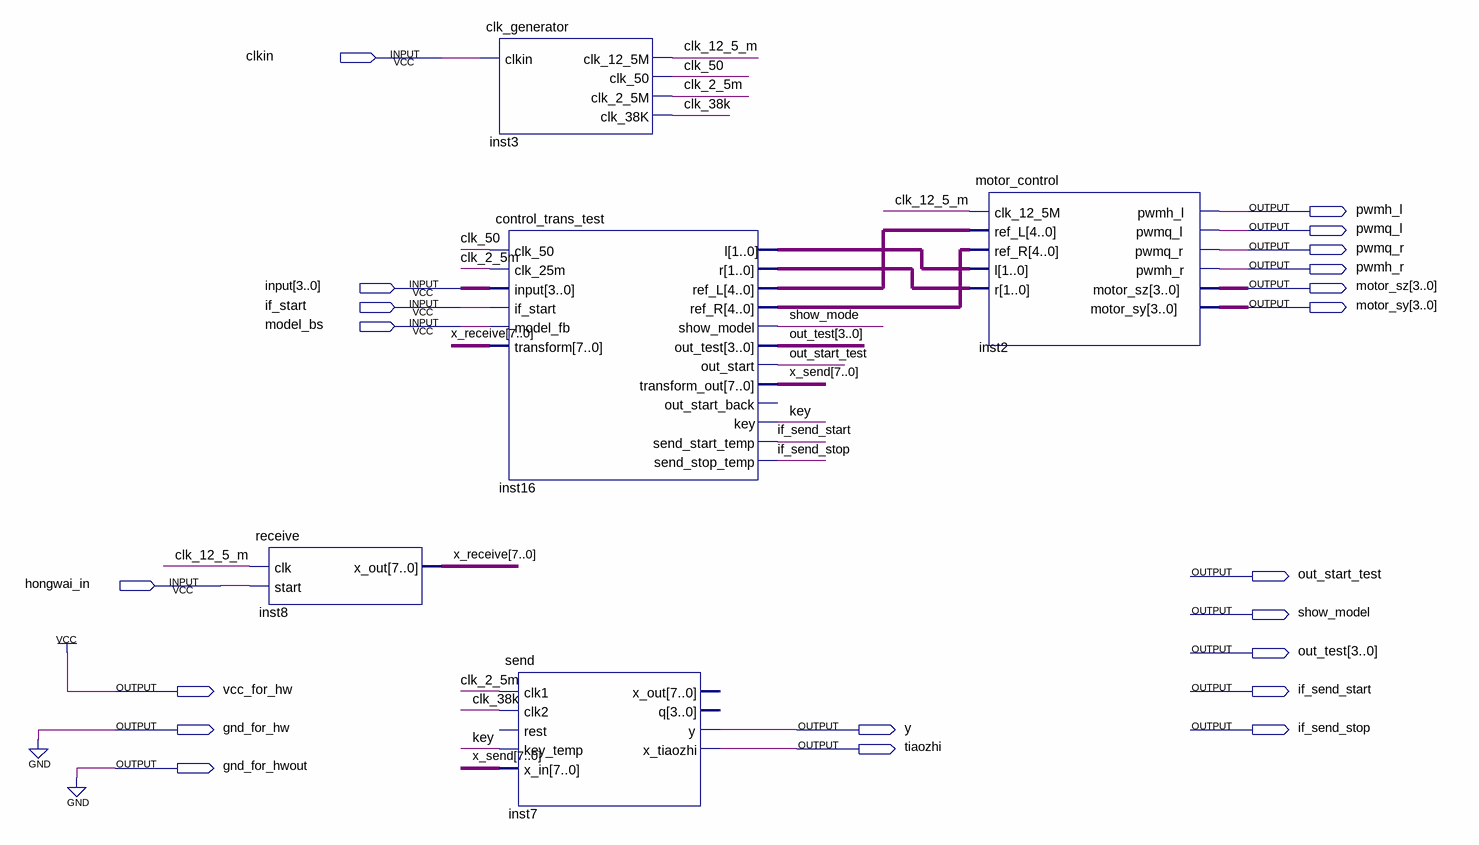
[diagram p0: schematic sheet]
// Quartus schematic car.bdf as structural Verilog: 5 symbols, 21 pins
module car (
  input  clkin,
  input  [3:0] \input ,
  input  if_start,
  input  model_bs,
  input  hongwai_in,
  output pwmh_l,
  output pwmq_l,
  output pwmq_r,
  output pwmh_r,
  output [3:0] motor_sz,
  output [3:0] motor_sy,
  output out_start_test,
  output show_model,
  output [3:0] out_test,
  output vcc_for_hw,
  output if_send_start,
  output gnd_for_hw,
  output y,
  output if_send_stop,
  output tiaozhi,
  output gnd_for_hwout
);

  wire clk_2_5m, clk_12_5_m, clk_38k, clk_50, key, show_mode;
  wire [1:0] inst16_l, inst16_r;
  wire [4:0] inst16_ref_l, inst16_ref_r;
  wire [7:0] x_receive, x_send;

  receive inst8 (.clk(clk_12_5_m), .start(hongwai_in), .x_out(x_receive));
  clk_generator inst3 (.clkin(clkin), .clk_12_5M(clk_12_5_m), .clk_50(clk_50), .clk_2_5M(clk_2_5m), .clk_38K(clk_38k));
  control_trans_test inst16 (
    .clk_50(clk_50), .clk_25m(clk_2_5m), .\input (\input ), .if_start(if_start), .model_fb(model_bs),
    .transform(x_receive), .l(inst16_l), .r(inst16_r), .ref_L(inst16_ref_l), .ref_R(inst16_ref_r),
    .show_model(show_mode), .out_test(out_test), .out_start(out_start_test), .transform_out(x_send),
    .key(key), .send_start_temp(if_send_start), .send_stop_temp(if_send_stop));  // open: out_start_back
  send inst7 (
    .clk1(clk_2_5m), .clk2(clk_38k), .key_temp(key), .x_in(x_send), .y(y), .x_tiaozhi(tiaozhi));  // open: rest, x_out, q
  motor_control inst2 (
    .clk_12_5M(clk_12_5_m), .ref_L(inst16_ref_l), .ref_R(inst16_ref_r), .l(inst16_l), .r(inst16_r),
    .pwmh_l(pwmh_l), .pwmq_l(pwmq_l), .pwmq_r(pwmq_r), .pwmh_r(pwmh_r), .motor_sz(motor_sz),
    .motor_sy(motor_sy));

  assign gnd_for_hw = 1'b0;
  assign gnd_for_hwout = 1'b0;
  assign vcc_for_hw = 1'b1;
endmodule
